# EAGLE design mag-baro (EAGLE 9.6.2)
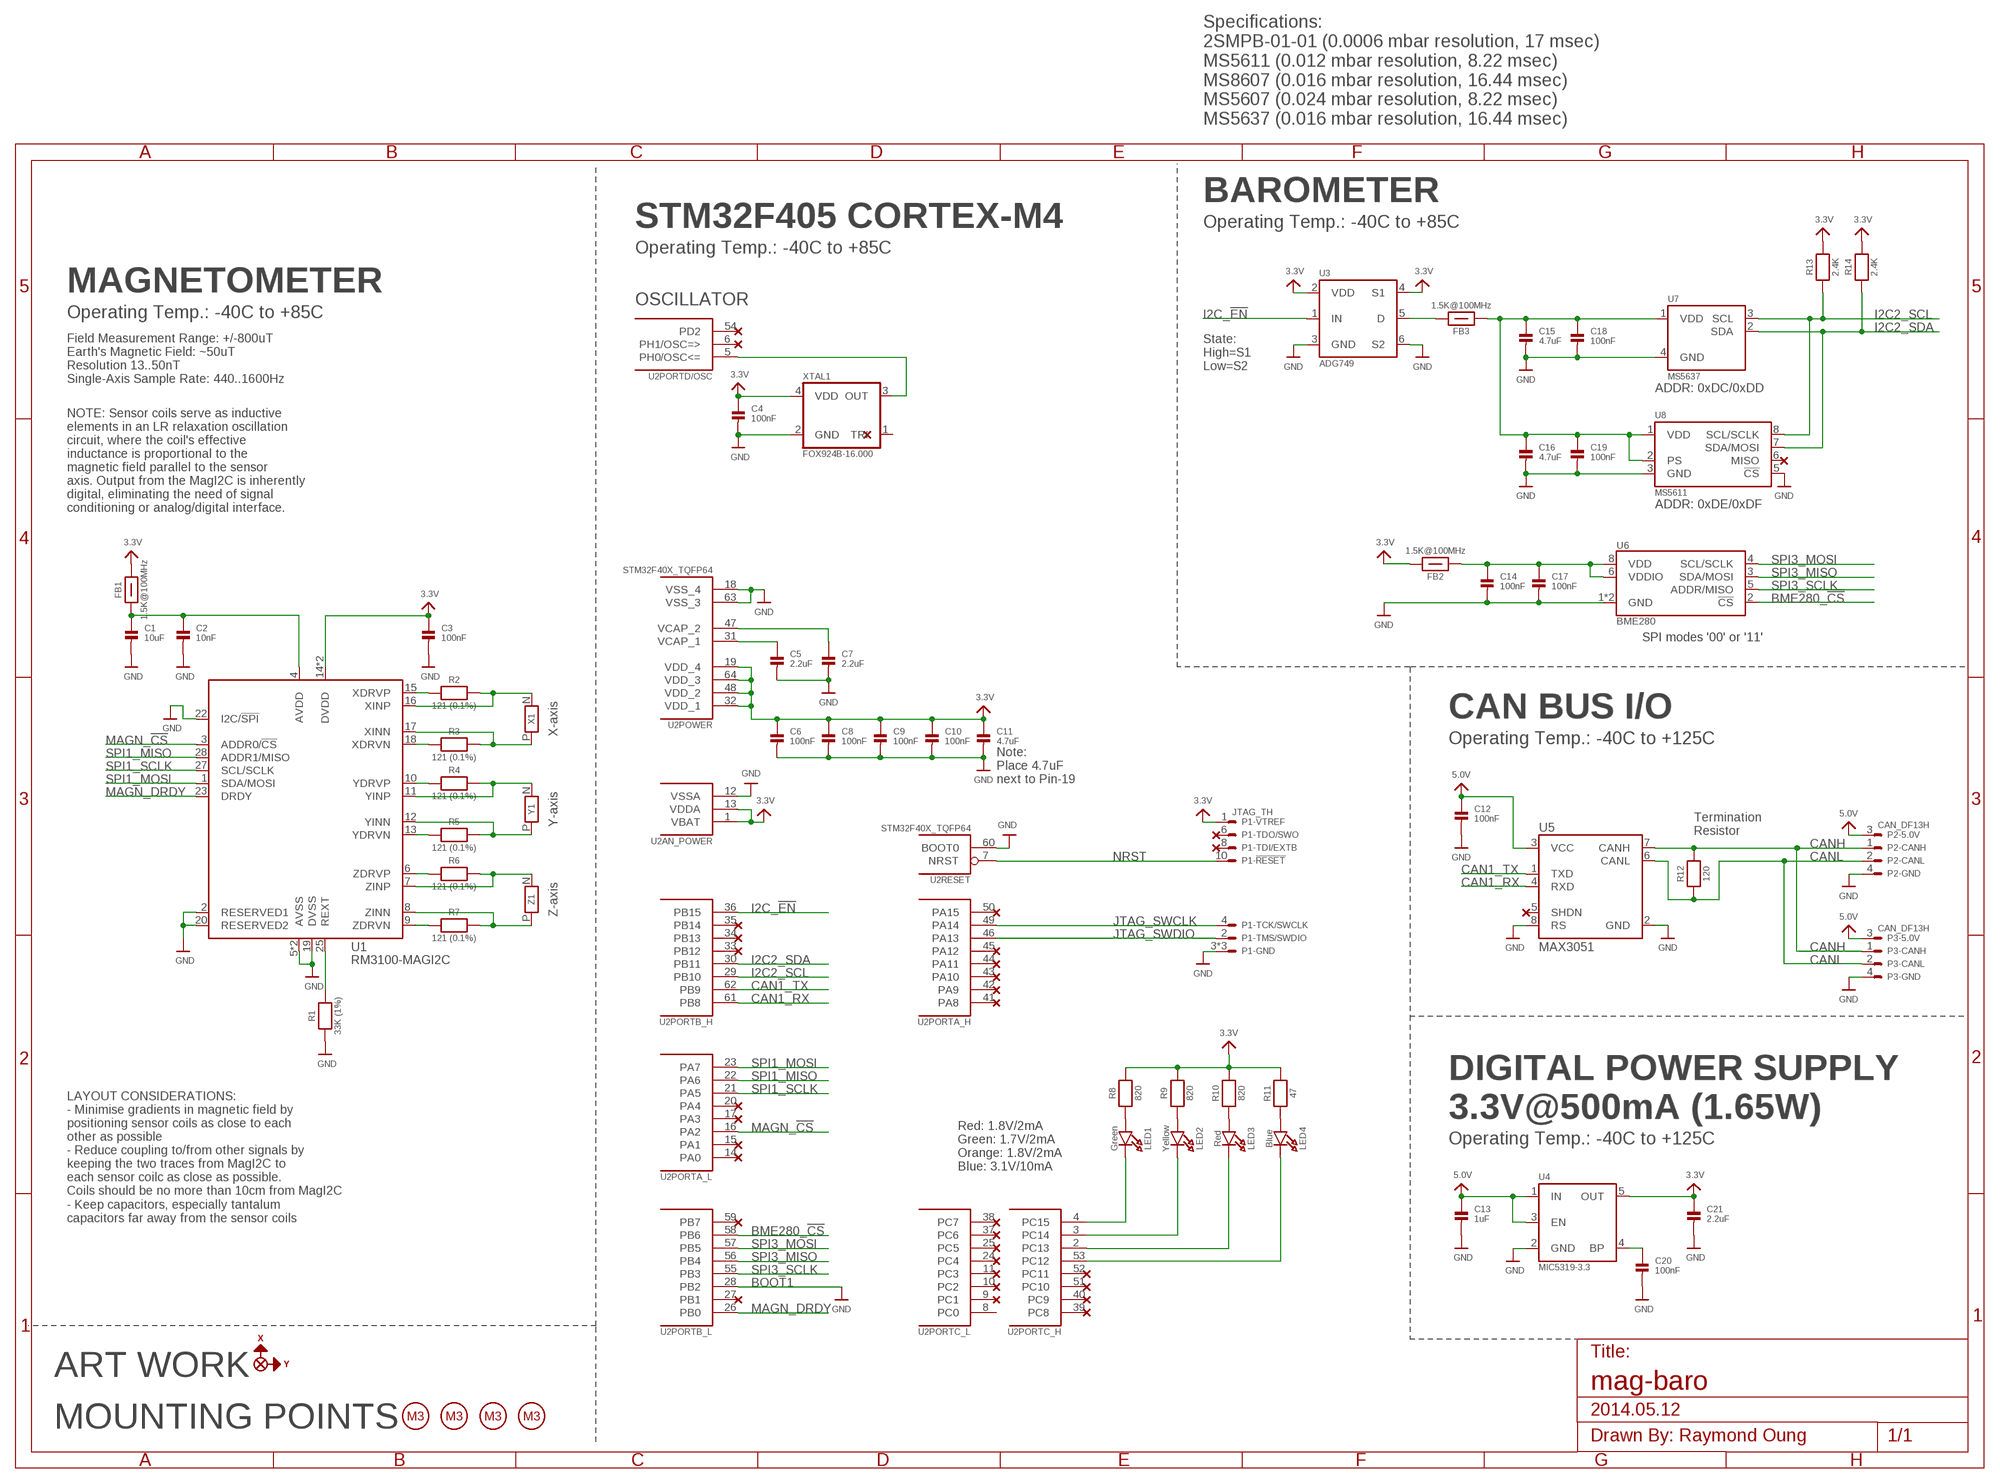
[diagram p0: schematic, sheet 1]

## Parts
AXIS3D2  AXIS3D_DOWN  [AXIS3D_DOWN]
C1  10uF  CAP_CERAMIC0402  [0402]
C2  10nF  CAP_CERAMIC0402  [0402]
C3  100nF  CAP_CERAMIC0402  [0402]
C4  100nF  CAP_CERAMIC0402  [0402]
C5  2.2uF  CAP_CERAMIC0402  [0402]
C6  100nF  CAP_CERAMIC0402  [0402]
C7  2.2uF  CAP_CERAMIC0402  [0402]
C8  100nF  CAP_CERAMIC0402  [0402]
C9  100nF  CAP_CERAMIC0402  [0402]
C10  100nF  CAP_CERAMIC0402  [0402]
C11  4.7uF  CAP_CERAMIC0402  [0402]
C12  100nF  CAP_CERAMIC0402  [0402]
C13  1uF  CAP_CERAMIC0402  [0402]
C14  100nF  CAP_CERAMIC0402  [0402]
C15  4.7uF  CAP_CERAMIC0402  [0402]
C16  4.7uF  CAP_CERAMIC0402  [0402]
C17  100nF  CAP_CERAMIC0402  [0402]
C18  100nF  CAP_CERAMIC0402  [0402]
C19  100nF  CAP_CERAMIC0402  [0402]
C20  100nF  CAP_CERAMIC0402  [0402]
C21  2.2uF  CAP_CERAMIC0402  [0402]
FB1  1.5K@100MHz  FERRITE_0402  [0402]
FB2  1.5K@100MHz  FERRITE_0402  [0402]
FB3  1.5K@100MHz  FERRITE_0402  [0402]
LED1  Green  LED_0603  [CHIPLED_0603]
LED2  Yellow  LED_0603  [CHIPLED_0603]
LED3  Red  LED_0603  [CHIPLED_0603]
LED4  Blue  LED_0603  [CHIPLED_0603]
MP1  M3_5  [MP_M3-5]
MP2  M3_5  [MP_M3-5]
MP3  M3_5  [MP_M3-5]
MP4  M3_5  [MP_M3-5]
P1  JTAG_TH  [FTSH-105-01-XXX-DV]
P2  CAN_DF13H  [DF13A-4P-1.25H]
P3  CAN_DF13H  [DF13A-4P-1.25H]
R1  33K (1%)  RESISTOR0402  [0402]
R2  121 (0.1%)  RESISTOR0402  [0402]
R3  121 (0.1%)  RESISTOR0402  [0402]
R4  121 (0.1%)  RESISTOR0402  [0402]
R5  121 (0.1%)  RESISTOR0402  [0402]
R6  121 (0.1%)  RESISTOR0402  [0402]
R7  121 (0.1%)  RESISTOR0402  [0402]
R8  820  RESISTOR0402  [0402]
R9  820  RESISTOR0402  [0402]
R10  820  RESISTOR0402  [0402]
R11  47  RESISTOR0402  [0402]
R12  120  RESISTOR0603  [0603]
R13  2.4K  RESISTOR0402  [0402]
R14  2.4K  RESISTOR0402  [0402]
U1  RM3100-MAGI2C  [RM3100-MAGI2C]
U2  STM32F40X_TQFP64  [TQFP64]
U3  ADG749  [SOT363]
U4  MIC5319-3.3  [SOT23-5]
U5  MAX3051  [SOT23-8]
U6  BME280  BME280_MANUAL  [BME280_LGA_MANUAL]
U7  MS5637  [MS5637]
U8  MS5611  [MS5611]
X1  RM3XXX-SEN-X  [RM3XXX-SEN-XY]
XTAL1  FOX924B-16.000  TCXO_5.0X3.2A  [OSCILLATOR-5.0X3.2A]
Y1  RM3XXX-SEN-Y  [RM3XXX-SEN-XY]
Z1  RM3XXX-SEN-Z  [RM3XXX-SEN_Z]

## Nets
3.3V [PWR]: C3.1 C4.1 C6.1 C8.1 C9.1 C10.1 C11.1 C21.1 FB1.2 FB2.2 P1.1 R8.2 R9.2 R10.2 R11.2 R13.2 R14.2 U1.14(DVDD) U1.26(DVDD) U2.1(AN_POWER:VBAT) U2.13(AN_POWER:VDDA) U2.19(POWER:VDD_4) U2.32(POWER:VDD_1) U2.48(POWER:VDD_2) U2.64(POWER:VDD_3) U3.2(VDD) U3.4(S1) U4.5(OUT) XTAL1.4(VDD)
5.0V [PWR]: C12.1 C13.1 P2.3 P3.3 U4.1(IN) U4.3(EN) U5.3(VCC)
A3.3V: C1.1 C2.1 FB1.1 U1.4(AVDD)
BME280_!CS: U2.58(PORTB_L:PB6) U6.2(!CS)
CAN1_RX: U2.61(PORTB_H:PB8) U5.4(RXD)
CAN1_TX: U2.62(PORTB_H:PB9) U5.1(TXD)
CANH: P2.1 P3.1 R12.2 U5.7(CANH)
CANL: P2.2 P3.2 R12.1 U5.6(CANL)
GND [PWR]: C1.2 C2.2 C3.2 C4.2 C5.2 C6.2 C7.2 C8.2 C9.2 C10.2 C11.2 C12.2 C13.2 C14.2 C15.2 C16.2 C17.2 C18.2 C19.2 C20.2 C21.2 P1.3 P1.5 P1.9 P2.4 P3.4 R1.1 U1.2(RESERVED1) U1.5(AVSS) U1.19(DVSS) U1.20(RESERVED2) U1.22(I2C/!SPI) U1.PAD(AVSS) U2.12(AN_POWER:VSSA) U2.18(POWER:VSS_4) U2.28(PORTB_L:PB2) U2.60(RESET:BOOT0) U2.63(POWER:VSS_3) U3.3(GND) U3.6(S2) U4.2(GND) U5.2(GND) U5.8(RS) U6.1(GND) U6.7(GND) U7.4(GND) U8.3(GND) U8.5(!CS) XTAL1.2(GND)
I2C2_SCL: R13.1 U2.29(PORTB_H:PB10) U7.3(SCL) U8.8(SCL/SCLK)
I2C2_SDA: R14.1 U2.30(PORTB_H:PB11) U7.2(SDA) U8.7(SDA/MOSI)
I2C_!EN: U2.36(PORTB_H:PB15) U3.1(IN)
JTAG_SWCLK: P1.4 U2.49(PORTA_H:PA14)
JTAG_SWDIO: P1.2 U2.46(PORTA_H:PA13)
MAGN_!CS: U1.3(ADDR0/!CS) U2.16(PORTA_L:PA2)
MAGN_DRDY: U1.23(DRDY) U2.26(PORTB_L:PB0)
N$1: R1.2 U1.25(REXT)
N$2 [PWR]: C15.1 C16.1 C18.1 C19.1 FB3.1 U7.1(VDD) U8.1(VDD) U8.2(PS)
N$3 [PWR]: C14.1 C17.1 FB2.1 U6.6(VDDIO) U6.8(VDD)
N$4: LED1.C U2.4(PORTC_H:PC15)
N$5: C20.1 U4.4(BP)
N$6: R2.1 U1.15(XDRVP)
N$7: R3.1 U1.18(XDRVN)
N$8: R2.2 U1.16(XINP) X1.N
N$9: FB3.2 U3.5(D)
N$10: U2.5(PORTD/OSC:PH0/OSC<=) XTAL1.3(OUT)
N$11: R3.2 U1.17(XINN) X1.P
N$12: LED1.A R8.1
N$13: LED2.A R9.1
N$14: LED4.A R11.1
N$15: LED2.C U2.3(PORTC_H:PC14)
N$16: LED3.C U2.2(PORTC_H:PC13)
N$17: LED4.C U2.53(PORTC_H:PC12)
N$18: LED3.A R10.1
N$25: R6.2 U1.7(ZINP) Z1.N
N$27: R4.1 U1.10(YDRVP)
N$28: R5.1 U1.13(YDRVN)
N$29: R6.1 U1.6(ZDRVP)
N$30: R7.1 U1.9(ZDRVN)
N$31: R4.2 U1.11(YINP) Y1.N
N$32: R5.2 U1.12(YINN) Y1.P
N$33: R7.2 U1.8(ZINN) Z1.P
NRST: P1.10 U2.7(RESET:NRST)
SPI1_MISO: U1.28(ADDR1/MISO) U2.22(PORTA_L:PA6)
SPI1_MOSI: U1.1(SDA/MOSI) U2.23(PORTA_L:PA7)
SPI1_SCLK: U1.27(SCL/SCLK) U2.21(PORTA_L:PA5)
SPI3_MISO: U2.56(PORTB_L:PB4) U6.5(ADDR/MISO)
SPI3_MOSI: U2.57(PORTB_L:PB5) U6.3(SDA/MOSI)
SPI3_SCLK: U2.55(PORTB_L:PB3) U6.4(SCL/SCLK)
VCAP_1 [PWR]: C5.1 U2.31(POWER:VCAP_1)
VCAP_2 [PWR]: C7.1 U2.47(POWER:VCAP_2)
Unconnected: P1.6 P1.8 U2.6(PORTD/OSC:PH1/OSC=>) U2.8(PORTC_L:PC0) U2.9(PORTC_L:PC1) U2.10(PORTC_L:PC2) U2.11(PORTC_L:PC3) U2.14(PORTA_L:PA0) U2.15(PORTA_L:PA1) U2.17(PORTA_L:PA3) U2.20(PORTA_L:PA4) U2.24(PORTC_L:PC4) U2.25(PORTC_L:PC5) U2.27(PORTB_L:PB1) U2.33(PORTB_H:PB12) U2.34(PORTB_H:PB13) U2.35(PORTB_H:PB14) U2.37(PORTC_L:PC6) U2.38(PORTC_L:PC7) U2.39(PORTC_H:PC8) U2.40(PORTC_H:PC9) U2.41(PORTA_H:PA8) U2.42(PORTA_H:PA9) U2.43(PORTA_H:PA10) U2.44(PORTA_H:PA11) U2.45(PORTA_H:PA12) U2.50(PORTA_H:PA15) U2.51(PORTC_H:PC10) U2.52(PORTC_H:PC11) U2.54(PORTD/OSC:PD2) U2.59(PORTB_L:PB7) U5.5(SHDN) U8.6(MISO) XTAL1.1(TRI)

## Notes on the sheet
- Specifications:
  2SMPB-01-01 (0.0006 mbar resolution, 17 msec)
  MS5611 (0.012 mbar resolution, 8.22 msec)
  MS8607 (0.016 mbar resolution, 16.44 msec)
  MS5607 (0.024 mbar resolution, 8.22 msec)
  MS5637 (0.016 mbar resolution, 16.44 msec)
- BAROMETER
- STM32F405 CORTEX-M4 | Operating Temp.: -40C to +85C
- Operating Temp.: -40C to +85C
- MAGNETOMETER
- OSCILLATOR
- Operating Temp.: -40C to +85C
- State:
  High=S1
  Low=S2
- Field Measurement Range: +/-800uT
  Earth's Magnetic Field: ~50uT
  Resolution 13..50nT
  Single-Axis Sample Rate: 440..1600Hz
- ADDR: 0xDC/0xDD
- ADDR: 0xDE/0xDF
- NOTE: Sensor coils serve as inductive
  elements in an LR relaxation oscillation
  circuit, where the coil's effective
  inductance is proportional to the 
  magnetic field parallel to the sensor 
  axis. Output from the MagI2C is inherently
  digital, eliminating the need of signal
  conditioning or analog/digital interface.
- SPI modes '00' or '11'
- X-axis | CAN BUS I/O
- Operating Temp.: -40C to +125C
- Note: 
  Place 4.7uF 
  next to Pin-19
- Y-axis
- Termination
  Resistor
- Z-axis
- DIGITAL POWER SUPPLY
  3.3V@500mA (1.65W)
- Operating Temp.: -40C to +125C
- Red: 1.8V/2mA
  Green: 1.7V/2mA
  Orange: 1.8V/2mA
  Blue: 3.1V/10mA
- LAYOUT CONSIDERATIONS:
  - Minimise gradients in magnetic field by
  positioning sensor coils as close to each
  other as possible
  - Reduce coupling to/from other signals by
  keeping the two traces from MagI2C to
  each sensor coilc as close as possible.
  Coils should be no more than 10cm from MagI2C
  - Keep capacitors, especially tantalum
  capacitors far away from the sensor coils
- BOOT1
- ART WORK
- 2014.05.12
- MOUNTING POINTS

## Library data of the parts
AXIS3D2 = custom-artwork:AXIS3D_DOWN: 3D Axes
C1-C21 = custom-generic:CAP_CERAMIC: Ceramic Capacitor 0402 - 0402 Surface Mount Capacitors 16pF 50V 5% [Digikey: 445-4899-2-ND] 18pF 50V 5% [Digikey: 490-1281-2-ND] 22pF 50V 5% [Digikey: 490-1283-2-ND] 68pF 50V 5% [Digikey: 490-1289-2-ND] 10nF 50V 10% {-55°C to 125°C} [Digikey: 490-4516-1-ND] 0.1uF 10V 10% {-55°C to 85°C} [Digikey: 490-1318-2-ND] 0.1uF 100V 10% {-55°C to 85°C} [Digikey: 490-10458-1-ND] 0.47uF 50V 10% {-55°C to 85°C} [Digikey: 587-3497-1-ND] 1.0uF 10V 10% {-55°C to 105°C} [Digikey: 445-7368-1-ND] 2.2uF 10V 10% {-55°C to 125°C} [Digikey: 445-9097-1-ND] 4.7uF 10V 10% {-55°C to 85°C} [Digikey: 445-13820-1-ND] 0603 - 0603 Surface Mount Capacitors 16 pF 50V 5% [Digikey: 445-5051-2-ND] 22 pF 50V [Digikey: PCC220ACVTR-ND] 33 pF 50V 5% [Digikey: 490-1415-1-ND] 56pF 50V 5% [Digikey: 490-1421-1-ND] 220pF 50V 5% [Digikey: 445-1285-1-ND] 680 pF 50V 2200 pF 50V 5% C0G [Digikey: 445-1297-1-ND] 5600 pF 100V 5% X7R [Digikey: 478-3711-1-ND] 0.1 µF 25V 10% [Digikey: PCC2277TR-ND] 0.22 µF 16V 10% X7R [Digikey: 445-1318-1-ND] 1.0 µF 25V 10% [Digikey: 445-5146-2-ND] 0603 - RF Specific 3pF 250V +/-0.1pF RF [Digikey: 712-1347-1-ND] 18 pF 250V 5% [Digikey: 478-3505-1-ND or 712-1322-1-ND] 56 pF 250V 5% C0G RF [Digikey: 490-4867-1-ND] 68 pF 250V RF [Digikey: 490-4868-1-ND] 0805 - 0805 Surface Mount Capacitors 220 pF 250V 2% RF Ceramic Capacitor [Digikey: 712-1398-1-ND] 1000 pF 50V 2% NP0 Ceramic Capacitor [Digikey: 478-3760-1-ND] 0.1 µF 25V 10% Ceramic Capacitor [Digikey: PCC1828TR-ND] 1.0 µF 16V 10% Ceramic Capacitor[Digikey: 490-1691-2-ND] 10.0 µF 10V 10% Ceramic Capacitor[Digikey: 709-1228-1-ND] 10.0 uF 16V 10% Ceramic Capacitor [Digikey: 478-5165-2-ND] 47 uF 6.3V 20% Ceramic Capacitor [Digikey: 587-1779-1-ND or 399-5506-1-ND] 1206 - 1206 Surface Mount Capacitors 47uF 10V 20% Ceramic Capacitor [Digikey: 490-5528-1-ND or 399-5508-1-ND or 445-6010-1-ND]
FB1-FB3 = custom-generic:FERRITE: Ferrite Bead
LED1-LED4 = custom-generic:LED: LED 0603 - 0603 Surface Mount Package 2mA: Blue LED - Low Power (39.2mcd, 10 mA, 3.1Vf) - DigiKey: 475-1383-1-ND Green LED - Low Power (3.9mcd, 2mA, 1.7Vf) - Digikey: 475-2709-1-ND Orange LED - Low Power (9.8mcd, 2mA, 1.8Vf) - Digikey: 475-1194-2-ND Red LED - Low Power (5mcd, 2mA, 1.8Vf) - Digikey: 475-2506-1-ND Yellow LED - Low Power (7mcd, 2mA, 1.8Vf) - Digikey: 475-1196-1-ND 5mA: Blue LED - Low Power (17mcd, 5ma, 2.9Vf) - Digikey: LNJ937W8CRACT-ND 0805 - 0805 Surface Mount Package 2mA: Red LED (8.8mcd, 2mA, 1.8Vf, Clear) - Low Power [Digikey: 475-2510-1-ND] Green LED (5mcd, 2mA, 1.8Vf, Clear) - Low Power [Digikey: 475-2730-1-ND] Yellow LED (11.3mcd, 2mA, 1.8Vf, Clear) - Low Power [Digikey: 475-2555-1-ND] 20mA: Red LED (104mcd, 20mA, Diffused) - LS R976 [Digikey: 475-1278-6-ND] Red LED (12mcd, 20mA, 2.0Vf, Clear) - APT2012EC [Digikey: 754-1128-1-ND] Green LED (15mcd, 20mA, 2.2Vf, Clear) - APT2012GC [Digikey: 754-1131-1-ND] Orange LED (160mcd, 20mA, 2.1Vf, Clear) - APT2012SECK [Digikey: 754-1130-1-ND] 1206 - 1206 Surface Mount Package Green LED (26mcd, 20mA, Diffused) - LG N971 [Digikey: 475-1407-6-ND] Red LED (15mcd, 20mA, Diffused) - LH N974 [Digikey: 475-1416-6-ND]
MP1-MP4 = custom-mechanical:M3: Mounting Point M3
P1 = custom-connectors:JTAG: JTAG Connector; DIGI-KEY: 952-1383-ND; MOUSER: 855-M50-3500542; TEMPERATURE: -40°C to 105°C
P2 P3 = custom-connectors:CAN: CAN Bus Connector; DIGI-KEY: H3369-ND; MOUSER: 798-DF13A4P125H20
R1-R14 = custom-generic:RESISTOR: Resistors 0402 - 0402 Surface Mount Package 22 Ohm 1% 1/16W [Digikey: 311-22.0LRTR-ND] 33 Ohm 5% 1/16W 100 Ohm 1% 1/16W {-55°C to 155°C} [Digi-Key: 311-100LRCT-ND] 1.0K 5% 1/16W 1.5K 5% 1/16W 1.65K 1% 1/16W {-55°C to 155°C} [Digikey: YAG3043CT-ND] 2.0K 1% 1/16W 10.0K 1% 1/16W [Digikey: 311-10.0KLRTR-ND] 10.0K 5% 1/16W [Digikey: RMCF0402JT10K0TR-ND] 12.1K 1% 1/16W [Digikey: 311-22.0LRTR-ND] 33K 1% 1/16W {-55°C to 155°C} [Digikey: 311-33.0KLRCT-ND] 100.0K 5% 1/16W 0603 - 0603 Surface Mount Package 0 Ohm 1/10 Watt 1% Resistor 15 Ohm 1/10 Watt 1% Resistor 33 Ohm 1/10 Watt 1% Resistor 49.9 Ohm 1/10 Watt 1% Resistor 100 Ohm 1/10 Watt 1% Resistor 150 Ohm 1/10 Watt 1% Resistor 240 Ohm 1/10 Watt 1% Resistor 390 Ohm 1/10 Watt 1% Resistor 560 Ohm 1/10 Watt 1% Resistor 680 Ohm 1/10 Watt 1% Resistor 750 Ohm 1/10 Watt 1% Resistor 1.0K Ohm 1/10 Watt 1% Resistor 1.5K Ohm 1/10 Watt 1% Resistor 2.0K Ohm 1/10 Watt 1% Resistor 2.2K Ohm 1/10 Watt 1% Resistor 3.3K Ohm 1/10 Watt 1% Resistor 4.7K Ohm 1/10 Watt 1% Resistor 10.0K Ohm 1/10 Watt 1% Resistor 12.0K Ohm 1/10 Watt 1% Resistor 12.1K Ohm 1/10 Watt 1% Resistor 20.0K Ohm 1/10 Watt 1% Resistor 33.0K Ohm 1/10 Watt 1% Resistor 100.0K Ohm 1/10 Watt 1% Resistor 0805 - 0805 Surface Mount Package 0 Ohm 1/8 Watt 1% Resistor 33 Ohm 1/8 Watt 1% Resistor 100 Ohm 1/8 Watt 1% Resistor 150 Ohm 1/8 Watt 1% Resistor 200 Ohm 1/8 Watt 1% Resistor 240 Ohm 1/8 Watt 1% Resistor 330 Ohm 1/8 Watt 1% Resistor 390 Ohm 1/8 Watt 1% Resistor 470 Ohm 1/8 Watt 1% Resistor 1.0K Ohm 1/8 Watt 1% Resistor 1.5K Ohm 1/8 Watt 1% Resistor 2.0K Ohm 1/8 Watt 1% Resistor 4.7K Ohm 1/8 Watt 1% Resistor 5.1K Ohm 1/8 Watt 1% Resistor 5.6K Ohm 1/8 Watt 1% Resistor 10.0K Ohm 1/8 Watt 1% Resistor 22.0K Ohm 1/8 Watt 1% Resistor 33.0K Ohm 1/8 Watt 1% Resistor 100K Ohm 1/8 Watt 1% Resistor 1206 - 1206 Surface Mount Package 0.1 Ohm 1/2 Watt 1% {-55°C to 155°C} [Digikey: CSR1206FTR100CT-ND] 2012 - 2010 Surface Mount Package 0.11 Ohm 1/2 Watt 1% Resistor - Digikey: RHM.11UCT-ND
U1 = custom-devices:RM3100-MAGI2C: Magnetometer IC; PNI-CORP: 13156
U2 = custom-devices:STM32F40X_TQFP64: STM32F40x 64-pin LQFP; DIGI-KEY: 497-11767-ND; MOUSER: 511-STM32F405RGT6; TEMPERATURE: -40°C to +85°C
U3 = custom-devices:ADG749: 2:1 Multiplexer; DIGI-KEY: ADG749BKSZ-REEL7CT-ND; MOUSER: 584-ADG749BKSZ-R7
U4 = custom-devices:MIC5319-3.3: 3.3V Linear Voltage Regulator; DIGI-KEY: 576-1910-1-ND; MOUSER: 998-MIC5319-3.3YD5TR
U5 = custom-devices:MAX3051: CAN Transceiver; DIGI-KEY: MAX3051EKA+TCT-ND; MOUSER: 700-MAX3051EKAT; TEMPERATURE: -40°C to 85°C
U6 = custom-devices:BME280; DIGI-KEY: 828-1063-1-ND; MOUSER: 262-BME280; TEMPERATURE: -40 to 85°C
U7 = custom-devices:MS5637: Pressure Sensor; DIGI-KEY: 223-1199-1-ND; MOUSER: 824-MS5637-02BA04
U8 = custom-devices:MS5611: Pressure Sensor; DIGI-KEY: 223-1622-2-ND; FARNELL: 2362662; MOUSER: 824-MS561101BA03-50
X1 = custom-devices:RM3XXX-SEN-X: Magnetometer Sensor X-axis; PNI-CORP: 13104
XTAL1 = custom-generic:TCXO: Temperature Compensated Crystal Oscillator
Y1 = custom-devices:RM3XXX-SEN-Y: Magnetometer Sensor Y-axis; PNI-CORP: 13104
Z1 = custom-devices:RM3XXX-SEN-Z: Magnetometer Sensor Z-axis; PNI-CORP: 13101

## Net classes
0 default: width 0.152 mm, drill 0.305 mm, clearance 0.152 mm
1 PWR: width 0.203 mm, drill 0.305 mm, clearance 0.152 mm

## Board
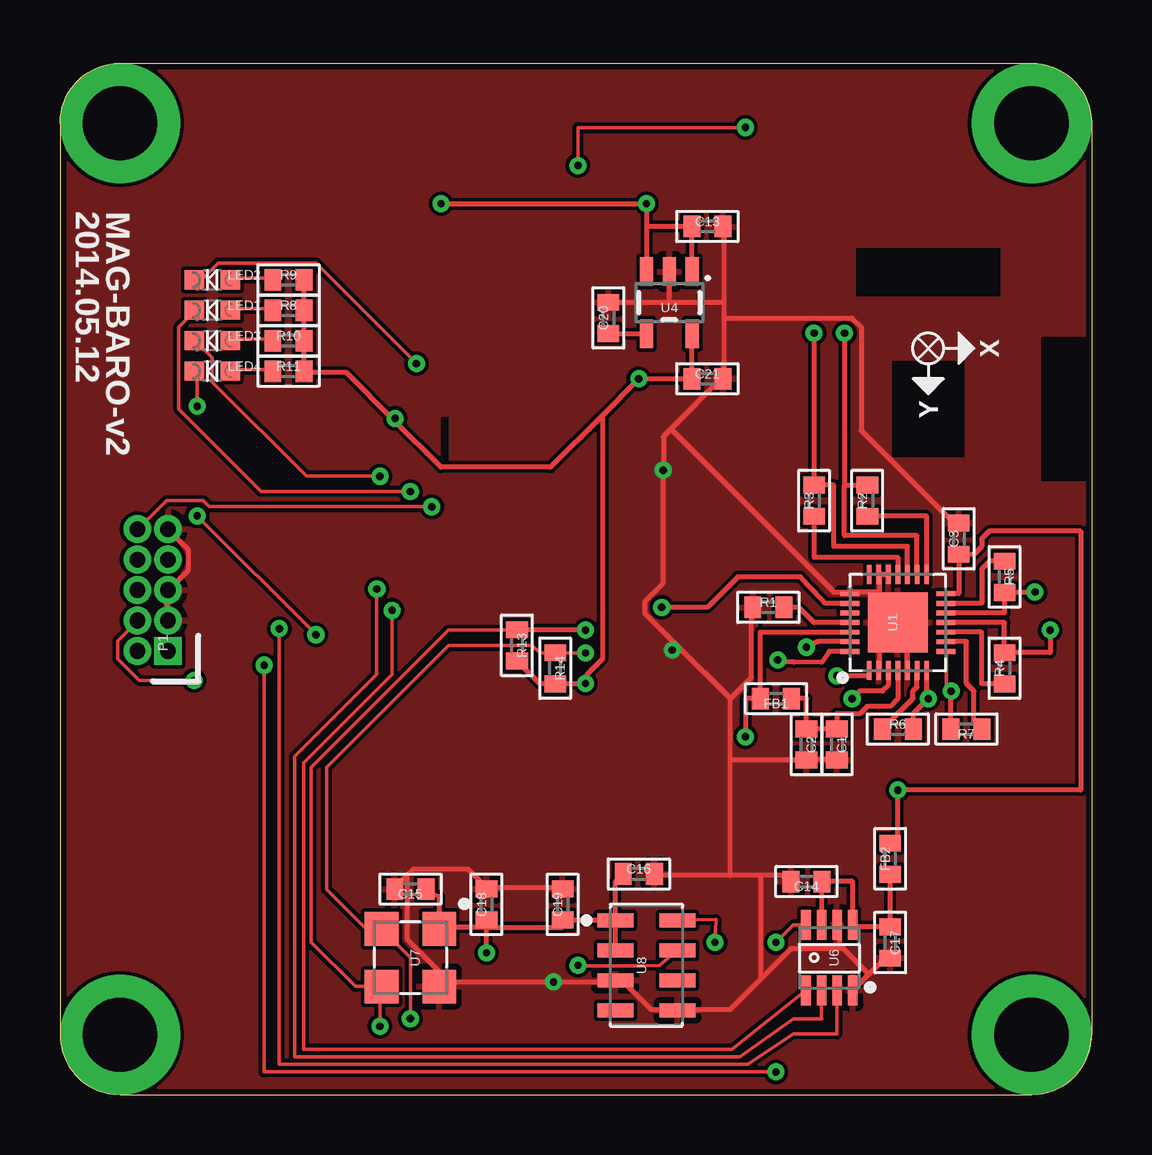
[diagram p1: board, top side]
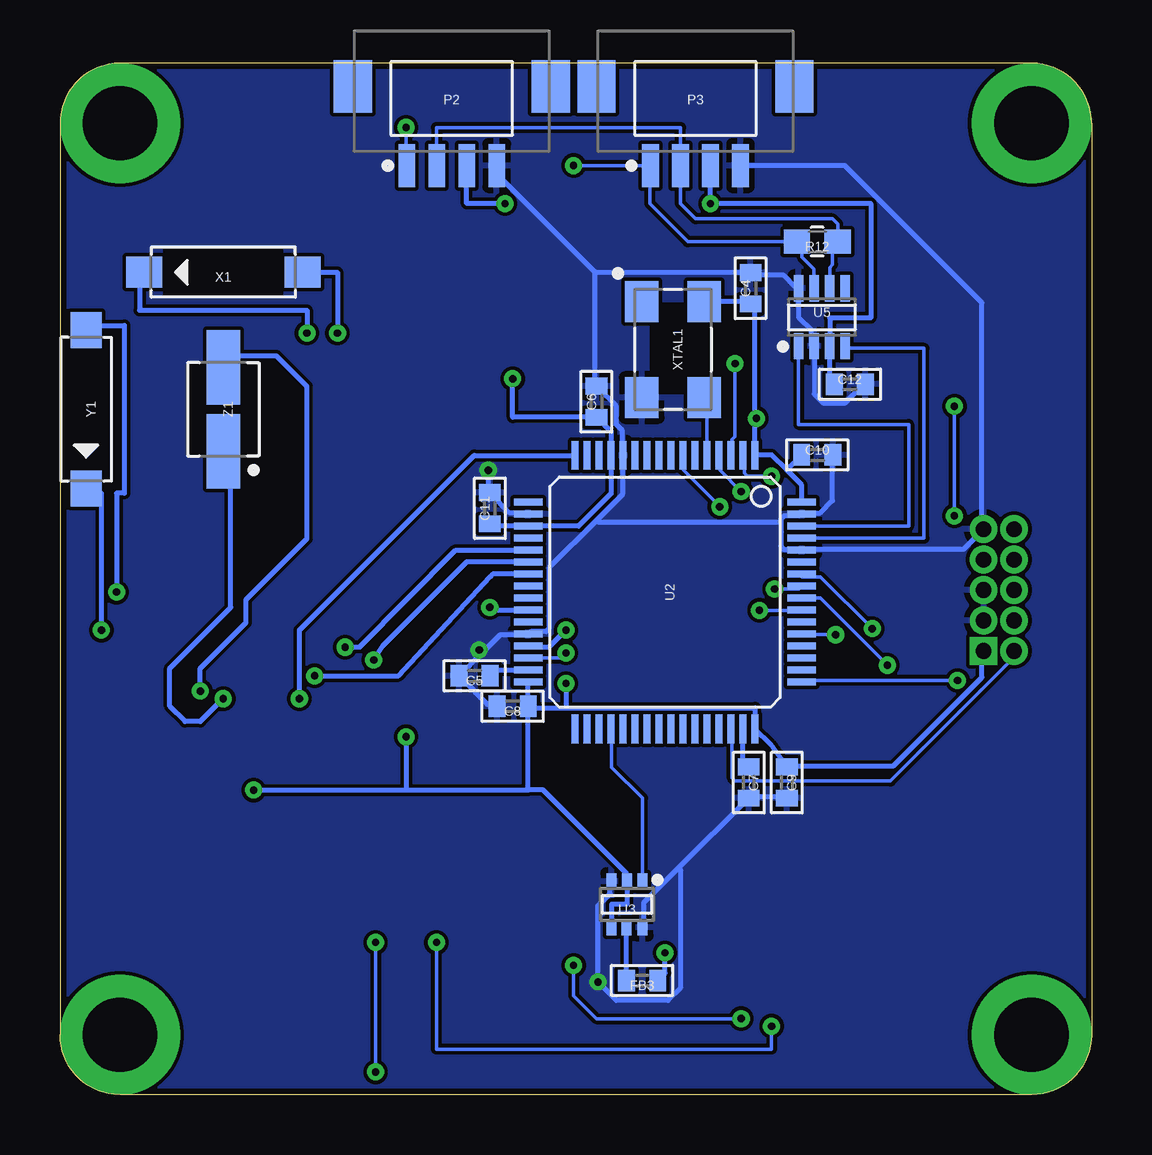
[diagram p2: board, bottom side, seen from below]

Size 43 x 43 mm. Coordinates in mm from the lower left corner, seen from the top.
Outline: 0,40.5 0,2.5 arc90 2.5,0 40.5,0 arc90 43,2.5 43,40.5 arc90 40.5,43 2.5,43 arc90 0,40.5
Copper layers (1*16): Top 0.035mm / dielectric 1.5mm / Bottom 0.035mm
Design rules "BetaLayout-2layer": minimum track width 6mil, minimum drill 8mil, track to track 6mil, track to pad 6mil, pad to pad 6mil, via to via 6mil, smd to smd 0mil, copper to edge 10mil, drill to drill 10mil, minimum pad ring 10mil, minimum via ring 8mil, stop-mask expansion 2mil, vias tented up to drill 100mil, thermal gap 10mil
tRestrict: area 15.9,26.4 to 16.2,28.3
bRestrict: area 16.5,29.2 to 18.4,33

### Footprints (pad centres in the part's own frame; a part is rotated, then mirrored left to right if it is on the bottom)
0402 = smd 0.7 x 0.9: 1 -0.65,0; 2 0.65,0
CHIPLED_0603 = smd 0.8 x 0.8: A 0,-0.75; C 0,0.75
MP_M3-5 = drill 3.1 pad 5: NC 0,0
FTSH-105-01-XXX-DV = drill 0.65 pad 1 square: 1 0,0 | drill 0.65 pad 1: 2 0,1.27; 3 1.27,0; 4 1.27,1.27; 5 2.54,0; 6 2.54,1.27; 7 3.81,0; 8 3.81,1.27; 9 5.08,0; 10 5.08,1.27
DF13A-4P-1.25H = smd 0.7 x 1.8: 1 -1.875,0; 2 -0.625,0; 3 0.625,0; 4 1.875,0 | smd 1.6 x 2.2: NC1 -4.125,3.3; NC2 4.125,3.3
0603 = smd 1.1 x 1: 1 -0.85,0; 2 0.85,0
RM3100-MAGI2C = smd 0.8 x 0.2: 1 -2,1.2; 2 -2,0.8; 3 -2,0.4; 4 -2,0; 5 -2,-0.4; 6 -2,-0.8; 7 -2,-1.2; 15 2,-1.2; 16 2,-0.8; 17 2,-0.4; 18 2,0; 19 2,0.4; 20 2,0.8; 21 2,1.2 | smd 0.2 x 0.8: 8 -1.2,-2; 9 -0.8,-2; 10 -0.4,-2; 11 0,-2; 12 0.4,-2; 13 0.8,-2; 14 1.2,-2; 22 1.2,2; 23 0.8,2; 24 0.4,2; 25 0,2; 26 -0.4,2; 27 -0.8,2; 28 -1.2,2 | smd 2.5 x 2.5: PAD 0,0
TQFP64 = smd 1.2 x 0.29: 1 -5.7,3.75; 2 -5.7,3.25; 3 -5.7,2.75; 4 -5.7,2.25; 5 -5.7,1.75; 6 -5.7,1.25; 7 -5.7,0.75; 8 -5.7,0.25; 9 -5.7,-0.25; 10 -5.7,-0.75; 11 -5.7,-1.25; 12 -5.7,-1.75; 13 -5.7,-2.25; 14 -5.7,-2.75; 15 -5.7,-3.25; 16 -5.7,-3.75; 33 5.7,-3.75; 34 5.7,-3.25; 35 5.7,-2.75; 36 5.7,-2.25; 37 5.7,-1.75; 38 5.7,-1.25; 39 5.7,-0.75; 40 5.7,-0.25; 41 5.7,0.25; 42 5.7,0.75; 43 5.7,1.25; 44 5.7,1.75; 45 5.7,2.25; 46 5.7,2.75; 47 5.7,3.25; 48 5.7,3.75 | smd 0.29 x 1.2: 17 -3.75,-5.7; 18 -3.25,-5.7; 19 -2.75,-5.7; 20 -2.25,-5.7; 21 -1.75,-5.7; 22 -1.25,-5.7; 23 -0.75,-5.7; 24 -0.25,-5.7; 25 0.25,-5.7; 26 0.75,-5.7; 27 1.25,-5.7; 28 1.75,-5.7; 29 2.25,-5.7; 30 2.75,-5.7; 31 3.25,-5.7; 32 3.75,-5.7; 49 3.75,5.7; 50 3.25,5.7; 51 2.75,5.7; 52 2.25,5.7; 53 1.75,5.7; 54 1.25,5.7; 55 0.75,5.7; 56 0.25,5.7; 57 -0.25,5.7; 58 -0.75,5.7; 59 -1.25,5.7; 60 -1.75,5.7; 61 -2.25,5.7; 62 -2.75,5.7; 63 -3.25,5.7; 64 -3.75,5.7
SOT363 = smd 0.42 x 0.7: 1 -0.65,-0.95; 2 0,-0.95; 3 0.65,-0.95; 4 0.65,0.95; 5 0.015,0.95; 6 -0.65,0.95
SOT23-5 = smd 0.55 x 1.2: 1 -0.95,-1.3; 2 0,-1.3; 3 0.95,-1.3; 4 0.95,1.3; 5 -0.95,1.3
SOT23-8 = smd 0.4 x 1.1: 1 -0.975,-1.204; 2 -0.325,-1.204; 3 0.325,-1.204; 4 0.975,-1.204; 5 0.975,1.204; 6 0.325,1.204; 7 -0.325,1.204; 8 -0.975,1.204
BME280_LGA_MANUAL = smd 1.25 x 0.4: 1 1.36,0.975; 2 1.36,0.325; 3 1.36,-0.325; 4 1.36,-0.975; 5 -1.36,-0.975; 6 -1.36,-0.325; 7 -1.36,0.325; 8 -1.36,0.975
MS5637 = smd 1.4 x 1.4: 1 -1.2,1.2; 2 -1.2,-1.2; 3 1.2,-1.2; 4 1.2,1.2
MS5611 = smd 1.5 x 0.6: 1 -1.3,1.875; 2 -1.3,0.625; 3 -1.3,-0.625; 4 -1.3,-1.875; 5 1.3,-1.875; 6 1.3,-0.625; 7 1.3,0.625; 8 1.3,1.875
RM3XXX-SEN-XY = smd 1.5 x 1.3: N 3.3,0; P -3.3,0
OSCILLATOR-5.0X3.2A = smd 1.7 x 1.4: 1 -2,-1.3; 2 2,-1.3; 3 2,1.3; 4 -2,1.3
RM3XXX-SEN_Z = smd 3.1 x 1.4: N 1.75,0; P -1.75,0

### Placement (x,y rotation side)
AXIS3D2  36.2,31.11 270 top
C1  32.38,14.61 270 top
C2  31.11,14.61 270 top
C3  37.47,23.18 90 top
C4  14.21,33.62 90 bottom
C5  25.72,17.46 180 bottom
C6  20.64,28.89 90 bottom
C7  14.29,13.02 270 bottom
C8  24.13,16.19 180 bottom
C9  12.7,13.02 270 bottom
C10  11.43,26.67 0 bottom
C11  25.08,24.45 90 bottom
C12  10.07,29.62 0 bottom
C13  26.99,36.2 0 top
C14  31.11,8.89 180 top
C15  14.61,8.57 180 top
C16  24.13,9.21 0 top
C17  34.61,6.35 270 top
C18  17.78,7.94 90 top
C19  20.95,7.94 90 top
C20  22.86,32.38 90 top
C21  26.99,29.84 0 top
FB1  29.84,16.51 180 top
FB2  34.61,9.84 90 top
FB3  18.73,4.76 180 bottom
LED1  6.35,32.7 90 top
LED2  6.35,33.97 90 top
LED3  6.35,31.43 90 top
LED4  6.35,30.16 90 top
MP1  2.5,2.5 0 top
MP2  40.5,2.5 0 top
MP3  2.5,40.5 0 top
MP4  40.5,40.5 0 top
P1  4.5,18.5 90 top
P2  26.67,38.73 0 bottom
P3  16.51,38.73 0 bottom
R1  29.53,20.32 0 top
R2  33.66,24.77 90 top
R3  31.43,24.77 90 top
R4  39.37,17.78 90 top
R5  39.37,21.59 270 top
R6  34.92,15.24 0 top
R7  37.78,15.24 180 top
R8  9.53,32.7 0 top
R9  9.53,33.97 0 top
R10  9.53,31.43 0 top
R11  9.53,30.16 0 top
R12  11.43,35.56 180 bottom
R13  19.05,18.73 270 top
R14  20.64,17.78 270 top
U1  34.92,19.68 90 top
U2  17.78,20.95 270 bottom
U3  19.37,7.94 180 bottom
U4  25.4,33.02 180 top
U5  11.24,32.41 0 bottom
U6  32.07,5.71 270 top
U7  14.61,5.71 270 top
U8  24.45,5.4 0 top
X1  36.2,34.29 180 bottom
XTAL1  17.45,31.06 270 bottom
Y1  41.91,28.57 270 bottom
Z1  36.2,28.57 270 bottom

### Tracks (layer width: path | path; a pad name or v marks a point on that pad's centre or on a via)
3.3V  (via drill 0.3)
  Top 0.203: U4.5 26.34,31.71 C21.1 v24.13,29.84 22.54,28.26 | R13.2 20,17.13 R14.2 20.65,17.14 v21.91,17.14 21.97,17.14 21.97,17.53 22.61,18.16 22.61,28.19 22.54,28.26 | U1.14 37.47,20.89 C3.1 38.09,22.53 38.42,22.86 38.42,23.18 38.73,23.5 42.55,23.5 42.55,12.7 v34.92,12.7 34.92,10.49 FB2.2 | v28.57,14.92 28.57,16.51 FB1.2 29.2,19.29 U1.26 | R9.2 10.16,33.91 10.16,32.77 R8.2 10.16,32.64 10.16,31.5 R10.2 10.16,31.37 10.16,30.23 R11.2 10.29,30.1 11.94,30.1 13.91,28.13 | 13.91,28.13 15.88,26.16 20.45,26.16 22.54,28.26 | v13.97,28.19 13.91,28.13
  Bottom 0.203: C11.1 25.08,23.7 U2.19 21.38,23.7 20.03,25.05 U2.13 20.03,27.65 20.32,27.94 20.32,28.24 C6.1 24.13,28.24 v24.13,29.84 | U3.4 20,6.99 20,7.94 19.37,7.94 U3.2 19.37,9.21 22.86,12.7 23.48,12.7 | XTAL1.4 14.29,33.06 C4.1 14.03,32.97 14.03,28.19 | 14.03,28.19 U2.1 14.02,26.67 13.34,26.67 12.7,26.04 | C8.1 U2.32 | 21.91,16.13 23.37,16.13 C8.1 | 21.91,16.13 14.03,16.13 U2.48 13.39,14.62 C9.1 12.7,13.72 8.26,13.72 4.57,17.4 4.57,18.41 P1.1 | U2.64 12.08,25.41 12.7,26.04 | C10.1 12.08,26.66 12.7,26.04 | v21.91,17.14 21.91,16.13 | v34.92,12.7 28.57,12.7 | 28.57,12.7 23.48,12.7 | 23.48,12.7 C8.1 | v28.57,14.92 28.57,12.7 | v13.97,28.19 14.03,28.19
5.0V  (via drill 0.3)
  Top 0.203: U4.1 26.35,35.9 C13.1 24.45,36.2 | v15.88,37.15 v24.45,37.15 24.45,36.2 | 24.45,36.2 U4.3
  Bottom 0.203: C12.1 10.91,29.62 U5.3 10.91,32.38 9.21,32.38 9.21,37.15 v15.88,37.15 P3.3 | v24.45,37.15 26.05,37.15 P2.3
A3.3V
  Top 0.203: U1.4 34.92,16.51 34.61,16.19 33.66,16.19 33.34,15.88 32.38,15.88 C1.1 C2.1 31.11,16.51 FB1.1
BME280_!CS  (via drill 0.3)
  Top 0.152: U6.2 32.38,2.54 30.58,2.54 28.67,1.27 9.14,1.27 v9.14,19.43
  Bottom 0.152: v9.14,19.43 11.3,21.59 12.06,21.59 U2.58
CAN1_RX
  Bottom 0.152: U2.61 6.99,23.2 6.99,31.11 10.26,31.11 U5.4
CAN1_TX
  Bottom 0.152: U5.1 12.21,27.94 7.62,27.94 7.62,23.7 U2.62
CANH  (via drill 0.3)
  Top 0.152: v21.59,38.73 21.59,40.32 v28.57,40.32
  Bottom 0.152: 18.41,38.7 18.41,37.15 16.83,35.56 R12.2 12.06,35.34 12.06,34.92 11.56,34.42 U5.7 | 18.41,38.7 P3.1 | 18.41,38.7 18.41,38.73 v21.59,38.73 | v28.57,40.32 28.57,38.73 P2.1
CANL
  Bottom 0.152: U5.6 10.91,34.49 10.79,34.61 10.79,35.34 R12.1 10.58,36.3 10.79,36.51 16.51,36.51 17.14,37.15 P3.2 17.14,40.32 27.3,40.32 P2.2
GND  (via drill 0.3)
  Top 0.203: 25.4,34.42 U4.2 25.4,33.02 | P1.3 4.45,19.81 4.45,20.95 P1.5 4.57,21.08 5.33,21.84 5.33,22.73 4.57,23.5 P1.9 | 34.16,20.95 34.16,21.59 U1.20 34.16,21.72 34.54,21.72 U1.19 | 34.16,20.95 34.16,19.68 | 34.16,19.68 34.16,17.78 U1.2 | 34.16,20.95 33.02,20.95 U1.22 32.89,20.95 32.26,20.95 25.46,27.75 | U1.5 35.31,17.78 35.31,19.3 U1.PAD 34.16,19.68 | 27.69,33.02 27.69,36.2 C13.2 | 27.69,33.02 27.69,32.38 | 27.69,32.38 27.69,29.84 C21.2 27.56,29.84 25.46,27.75 | 27.69,32.38 33.02,32.38 33.4,32 33.4,27.69 37.21,23.88 37.47,23.88 C3.2 | 27.69,33.02 25.4,33.02 | 25.4,33.02 C20.2 | 25.46,27.75 25.15,27.43 v25.15,26.04 25.15,21.34 24.38,20.57 24.38,20.07 25.72,18.73 | C2.2 C1.2 | 29.21,9.14 30.1,9.14 30.35,8.89 C14.2 | 29.21,9.14 27.94,9.14 | 27.94,9.14 24.89,9.14 C16.2 | 27.94,16.51 28.83,17.4 28.83,20.32 R1.1 | 27.94,9.14 27.94,13.97 | 27.94,13.97 27.94,16.51 | 27.94,13.97 C2.2 | C2.2 | 33.72,5.02 33.15,4.45 U6.1 | 33.72,5.02 34.29,5.59 34.54,5.59 C17.2 | 33.72,5.02 32.58,6.16 | 32.58,6.16 32.51,6.22 32.51,6.99 U6.7 | 14.41,9.08 14.73,9.4 17.02,9.4 17.78,8.64 | 14.41,9.08 13.97,8.64 C15.2 | 17.78,8.64 20.95,8.64 C19.2 | 17.78,8.64 C18.2 | 15.75,4.7 15.75,5.21 14.48,6.48 14.48,9.02 14.41,9.08 | 15.75,4.7 15.75,4.57 U7.4 15.75,4.7 | 15.75,4.7 v20.57,4.7 23.11,4.7 U8.3 23.24,4.7 23.5,4.7 24.64,3.56 25.65,3.56 U8.5 25.78,3.56 27.94,3.56 29.27,4.89 | 29.27,4.89 30.48,6.1 32.51,6.1 32.58,6.16 | 29.21,9.14 29.21,4.95 29.27,4.89 | 27.94,16.51 25.72,18.73 | 25.72,18.73 v25.53,18.54
  Bottom 0.203: C10.2 10.79,26.67 10.79,24.77 11.3,24.26 12.06,24.26 U2.63 12.19,24.13 12.83,24.13 12.95,24 12.95,23.88 | 12.95,23.88 12.95,22.86 12.83,22.73 12.19,22.73 U2.60 12.06,22.73 5.33,22.73 4.57,23.5 P1.9 4.57,23.62 4.57,33.02 10.29,38.73 P3.4 | C12.2 9.53,29.59 10.29,28.83 11.18,28.83 11.56,29.21 11.56,31.11 U5.2 11.68,31.24 11.68,31.88 12.19,32.38 12.19,33.53 U5.8 12.32,33.66 12.83,34.16 14.1,34.16 C4.2 14.22,34.29 20.7,34.29 | C8.2 24.89,16.26 25.15,16.26 26.29,17.4 C5.2 26.29,17.53 25.46,18.35 | 25.46,18.35 24.64,19.18 23.5,19.18 U2.28 23.37,19.3 22.73,19.3 22.61,19.43 22.61,21.97 20.64,23.94 | 20.7,34.29 24.77,38.35 24.77,38.73 P2.4 | 20.7,34.29 20.7,29.59 C6.2 20.57,29.46 19.81,28.7 19.81,27.94 19.56,27.69 19.56,26.67 U2.12 19.56,26.54 19.56,25.02 20.64,23.94 | 12.95,23.88 20.57,23.88 20.64,23.94 | U2.18 23.5,24.26 24.26,24.26 25.02,25.02 C11.2 25.15,25.15 v25.15,26.04 | 17.21,9.46 14.35,12.32 C7.2 14.22,12.45 12.7,12.45 C9.2 | 17.21,9.46 18.67,8 18.67,7.11 U3.6 | U3.3 20.07,8.76 20.07,8.38 20.57,7.87 v20.57,4.7 19.81,3.94 17.65,3.94 17.14,4.45 17.14,9.4 17.21,9.46 | v25.53,18.54 25.53,18.41 25.46,18.35
  pour Bottom: 2.51,0 40.51,0 arc90 43.01,2.5 43.01,40.5 arc90 40.51,43 2.51,43 arc90 0.01,40.5 0.01,2.5 arc90
  pour Top: 2.51,0.01 40.51,0.01 arc90 43.01,2.51 43.01,40.51 arc90 40.51,43.01 2.51,43.01 arc90 0.01,40.51 0.01,2.51 arc90
I2C2_SCL  (via drill 0.3)
  Top 0.152: U8.8 27.34,7.3 v27.3,6.35 | R13.1 19.04,19.37 16.19,19.37 10.48,13.65 10.48,6.35 12.31,4.51 U7.3 13.34,4.45 v13.34,2.86
  Top 0.203: v21.91,19.37 19.07,19.37 R13.1
  Bottom 0.152: v13.34,2.86 13.34,1.91 27.3,1.91 v27.3,6.35 | 23.37,18.67 U2.29
  Bottom 0.203: 23.37,18.67 22.61,18.67 v21.91,19.37
I2C2_SDA  (via drill 0.3)
  Top 0.152: U8.7 24.98,5.39 24.33,5.37 21.61,5.37 v21.59,5.4 | v14.61,3.17 14.61,5.71 U7.2 12.77,6.92 11.11,8.57 11.11,13.65 16.19,18.73 19.68,18.73 20,18.41 20.62,18.41 R14.1 20.64,18.41 v21.91,18.41
  Bottom 0.152: v21.59,5.4 21.59,4.13 20.64,3.17 v14.61,3.17 | U2.30 21.91,18.2 v21.91,18.41
I2C_!EN
  Bottom 0.152: U3.1 18.72,12.37 20,13.65 20,15.23 U2.36
JTAG_SWCLK  (via drill 0.3)
  Top 0.152: v5.59,17.27 3.3,17.27 2.41,18.16 2.41,18.92 3.17,19.68 P1.4
  Bottom 0.152: v5.59,17.27 12.06,17.27 U2.49
JTAG_SWDIO
  Bottom 0.152: P1.2 3.3,18.41 3.3,18.16 8.38,13.08 14.86,13.08 14.99,13.21 14.99,15.24 U2.46
MAGN_!CS  (via drill 0.3)
  Top 0.203: U1.3 34.52,17.06 34.29,16.83 33.34,16.83 v33.02,16.51
  Bottom 0.203: v33.02,16.51 33.02,19.37 25.73,26.66 U2.16
MAGN_DRDY  (via drill 0.3)
  Top 0.203: U1.23 31.9,20.48 31.75,20.64 30.87,21.59 28.26,21.59 26.99,20.32 v25.08,20.32
  Bottom 0.203: v25.08,20.32 24.97,20.2 U2.26
N$1
  Top 0.203: U1.25 31.43,19.68 30.8,20.32 R1.2
N$2  (via drill 0.3)
  Top 0.203: U8.2 U8.1 | 17.78,6.99 20.95,6.99 C19.1 23.13,7.29 U8.1 | 17.78,6.99 C18.1 | C15.1 15.8,8.26 U7.1 15.88,6.99 17.78,6.99 | U8.1 23.15,8.88 C16.1 | v17.78,5.92 17.78,6.99
  Bottom 0.203: FB3.1 17.78,5.07 v17.78,5.92
N$3
  Top 0.203: U6.6 31.74,8.89 C14.1 33.04,8.89 U6.8 | 33.04,7.29 U6.8 | FB2.1 C17.1 33.04,7 U6.8
N$4  (via drill 0.3)
  Top 0.152: v14.61,25.15 8.38,25.15 4.95,28.57 4.95,32 5.59,32.64 LED1.C
  Bottom 0.152: v14.61,25.15 15.49,26.04 15.49,26.54 U2.4
N$5
  Top 0.152: 24.43,31.73 U4.4
  Top 0.203: C20.1 24.43,31.73
N$6
  Top 0.203: U1.15 36.12,24.11 R2.1
N$7
  Top 0.203: R3.1 31.43,22.42 34.92,22.42 U1.18
N$8  (via drill 0.3)
  Top 0.203: v32.7,31.75 32.7,25.41 | 32.7,25.41 R2.2 | U1.16 35.73,23.3 32.7,23.3 32.7,25.41
  Bottom 0.203: X1.N arc-90 39.69,34.1 39.69,32.7 32.7,32.7 v32.7,31.75
N$9
  Bottom 0.203: FB3.2 U3.5
N$10
  Bottom 0.152: U2.5 16.03,28.94 XTAL1.3
N$11  (via drill 0.3)
  Top 0.203: v31.43,31.75 R3.2 32.26,25.41 32.26,22.86 35.33,22.86 U1.17
  Bottom 0.203: X1.P 31.43,34.29 v31.43,31.75
N$12
  Top 0.152: LED1.A 7.11,32.77 8.76,32.77 R8.1
N$13
  Top 0.152: LED2.A 7.11,34.04 8.76,34.04 R9.1
N$14
  Top 0.152: LED4.A 7.11,30.23 8.76,30.23 R11.1
N$15  (via drill 0.3)
  Top 0.152: v14.86,30.48 10.67,34.67 6.6,34.67 5.97,34.04 5.71,34.04 LED2.C
  Bottom 0.152: v14.86,30.48 14.86,27.43 14.99,27.3 14.99,26.67 U2.3
N$16  (via drill 0.3)
  Top 0.152: 5.71,31.43 LED3.C 5.71,31.37 6.35,30.73 6.35,29.72 10.29,25.78 v13.34,25.78
  Bottom 0.152: v13.34,25.78 14.35,25.78 14.48,25.91 14.48,26.54 U2.2
N$17  (via drill 0.3)
  Top 0.152: 5.59,30.16 LED4.C 5.71,30.1 v5.71,28.7 | v10.67,19.18 v5.71,24.13
  Bottom 0.152: v5.71,24.13 v5.71,28.7 | v10.67,19.18 12.06,19.18 U2.53
N$18
  Top 0.152: LED3.A 7.11,31.5 8.76,31.5 R10.1
N$25  (via drill 0.3)
  Top 0.203: R6.2 35.58,15.89 v36.2,16.51 36.12,16.58 U1.7
  Bottom 0.203: v36.2,16.51 37.15,15.56 37.78,15.56 38.42,16.19 38.42,17.78 35.88,20.32 35.88,26.51 Z1.N
N$27
  Top 0.203: R4.1 38.42,17.13 38.42,19.29 U1.10
N$28
  Top 0.203: R5.1 38.75,22.24 38.42,21.91 38.42,20.48 U1.13
N$29
  Top 0.203: R6.1 35.56,16.52 35.56,16.83 35.73,16.99 U1.6
N$30
  Top 0.203: R7.1 38.1,15.57 38.1,16.83 37.78,17.14 37.78,18.89 U1.9
N$31  (via drill 0.3)
  Top 0.203: v41.27,19.37 41.27,18.43 R4.2 | R4.2 39.37,18.41 | R4.2 39.37,19.68 U1.11
  Bottom 0.203: Y1.N 41.91,25.08 41.27,25.08 v41.27,19.37
N$32  (via drill 0.3)
  Top 0.203: v40.64,20.95 40.32,20.94 R5.2 39.37,20.09 U1.12
  Bottom 0.203: Y1.P 41.78,32.07 40.32,32.07 40.32,25.08 40.64,25.08 v40.64,20.95
N$33  (via drill 0.3)
  Top 0.152: v37.15,16.83 36.96,17.02 36.96,18.41 U1.8
  Top 0.203: R7.2 37.13,16.5 v37.15,16.83
  Bottom 0.203: v37.15,16.83 37.15,17.78 35.24,19.68 35.24,20.64 32.7,23.18 32.7,29.53 33.97,30.8 35.72,30.8 Z1.P
NRST  (via drill 0.3)
  Top 0.152: v15.49,24.51 6.22,24.51 5.97,24.77 4.45,24.77 3.3,23.62 P1.10
  Bottom 0.152: v15.49,24.51 17.02,26.04 17.02,26.54 U2.7
SPI1_MISO  (via drill 0.3)
  Top 0.203: U1.28 32.07,18.48 31.75,18.02 30.61,18.03 30.01,18.03 v29.92,18.12
  Bottom 0.203: v29.92,18.12 29.53,18.73 26.04,22.23 23.5,22.23 U2.22
SPI1_MOSI  (via drill 0.3)
  Top 0.203: U1.1 33.73,17.46 v32.38,17.46
  Bottom 0.203: U2.23 24.97,21.7 25.08,21.59 28.89,17.46 v32.38,17.46
SPI1_SCLK  (via drill 0.3)
  Top 0.203: U1.27 31.6,18.89 v31.11,18.66
  Bottom 0.203: v31.11,18.66 30.5,18.66 26.51,22.7 U2.21
SPI3_MISO  (via drill 0.3)
  Top 0.152: U6.5 30.57,7.08 v29.84,6.35 | v29.84,0.95 8.51,0.95 v8.51,17.91
  Bottom 0.152: v29.84,6.35 v29.84,0.95 | v8.51,17.91 11.3,20.7 12.06,20.7 U2.56
SPI3_MOSI  (via drill 0.3)
  Top 0.152: U6.3 31.74,3.18 31.75,3.17 30.56,3.17 28.34,1.59 9.78,1.59 9.78,14.1 13.21,17.53 v13.21,21.08
  Bottom 0.152: v13.21,21.08 12.19,21.08 U2.57
SPI3_SCLK  (via drill 0.3)
  Top 0.152: U6.4 28.01,1.91 10.16,1.91 10.16,13.84 13.84,17.53 v13.84,20.19
  Bottom 0.152: v13.84,20.19 12.19,20.19 U2.55
VCAP_1
  Bottom 0.203: C5.1 24.82,17.7 U2.31
VCAP_2
  Bottom 0.203: C7.1 14.53,13.88 U2.47

### Text on the board
tPlace: 2014.05.12 | MAG-BARO-v2